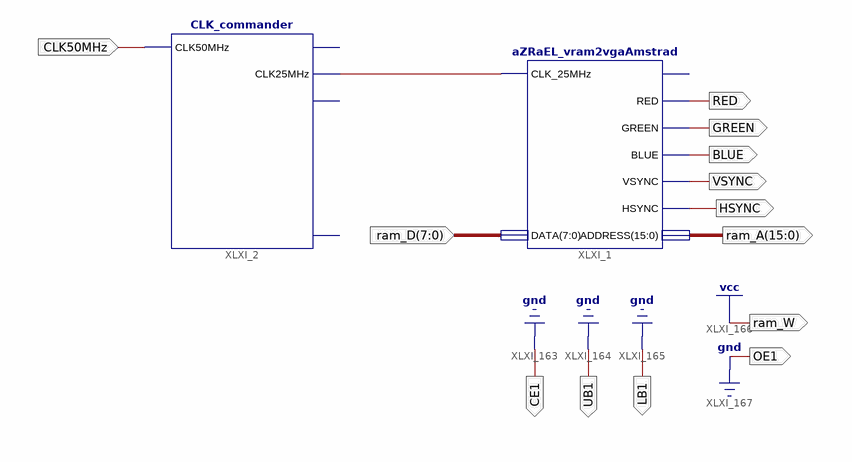
[diagram p0: schematic sheet 1]
// Xilinx ISE schematic amstrad_snapshoot_display.sch (spartan3) as structural Verilog: 2 symbols, 13 ports
module amstrad_snapshoot_display (
  input  [7:0] ram_D,
  input  CLK50MHz,
  output RED,
  output GREEN,
  output BLUE,
  output VSYNC,
  output HSYNC,
  output [15:0] ram_A,
  output CE1,
  output UB1,
  output LB1,
  output OE1,
  output ram_W
);

  wire XLXN_2;

  aZRaEL_vram2vgaAmstrad XLXI_1 (
    .CLK_25MHz(XLXN_2), .DATA(ram_D), .RED(RED), .GREEN(GREEN), .BLUE(BLUE), .VSYNC(VSYNC), .HSYNC(HSYNC),
    .ADDRESS(ram_A));  // open: R
  CLK_commander XLXI_2 (.CLK50MHz(CLK50MHz), .CLK25MHz(XLXN_2));  // open: CLK100MHz, CLK1MHz, CLK4MHz

  assign CE1 = 1'b0;
  assign LB1 = 1'b0;
  assign OE1 = 1'b0;
  assign ram_W = 1'b1;
  assign UB1 = 1'b0;
endmodule
